# EAGLE schematic verify (EAGLE 7.7.0)
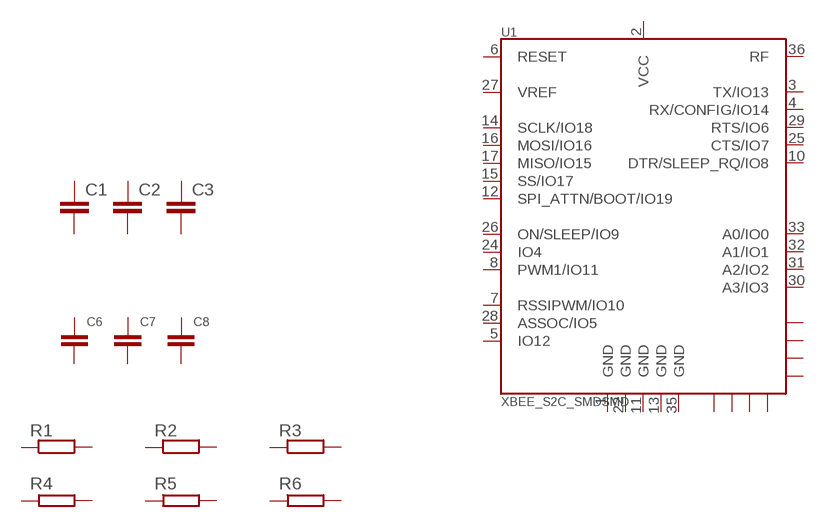
[diagram p0: schematic, sheet 1]

## Parts
C1  CAP0402-CAP  [0402-CAP]
C2  CAP0603-CAP  [0603-CAP]
C3  CAP0805  [0805]
C6  CAPACITOR0402  [CAP-0402]
C7  CAPACITOR0603  [CAP-0603]
C8  CAPACITOR0805  [CAP-0805]
R1  RESISTOR0402-RES  [0402-RES]
R2  RESISTOR0603-RES  [0603-RES]
R3  RESISTOR  [0805]
R4  RESISTOR0402  [RES-0402]
R5  RESISTOR0603  [RES-0603]
R6  RESISTOR0805  [RES-0805]
U1  XBEE_S2C_SMDSMD  [XBEE_S2C_SMD]
Unconnected: C1.1 C1.2 C2.1 C2.2 C3.1 C3.2 C6.1 C6.2 C7.1 C7.2 C8.1 C8.2 R1.1 R1.2 R2.1 R2.2 R3.1 R3.2 R4.1 R4.2 R5.1 R5.2 R6.1 R6.2 U1.1(GND) U1.2(VCC) U1.3(TX/IO13) U1.4(RX/CONFIG/IO14) U1.5(IO12) U1.6(RESET) U1.7(RSSIPWM/IO10) U1.8(PWM1/IO11) U1.9(N/C) U1.10(DTR/SLEEP_RQ/IO8) U1.11(GND) U1.12(SPI_ATTN/BOOT/IO19) U1.13(GND) U1.14(SCLK/IO18) U1.15(SS/IO17) U1.16(MOSI/IO16) U1.17(MISO/IO15) U1.18(N/C) U1.19(N/C) U1.20(N/C) U1.21(N/C) U1.22(GND) U1.23(N/C) U1.24(IO4) U1.25(CTS/IO7) U1.26(ON/SLEEP/IO9) U1.27(VREF) U1.28(ASSOC/IO5) U1.29(RTS/IO6) U1.30(A3/IO3) U1.31(A2/IO2) U1.32(A1/IO1) U1.33(A0/IO0) U1.34(N/C) U1.35(GND) U1.36(RF) U1.37(N/C)

## Library data of the parts
C1-C3 = EmbeddedAdventures 3:CAP: Capacitor
C6-C8 = DR_passives:CAPACITOR
R1-R3 = EmbeddedAdventures 3:RESISTOR: Resistor Basic schematic elements and footprints for 0603, 1206, and PTH 1/10th watt (small) resistors.
R4-R6 = DR_passives:RESISTOR
U1 = dr-library:XBEE_S2C_SMD